# EAGLE schematic display1 (EAGLE 6.1)
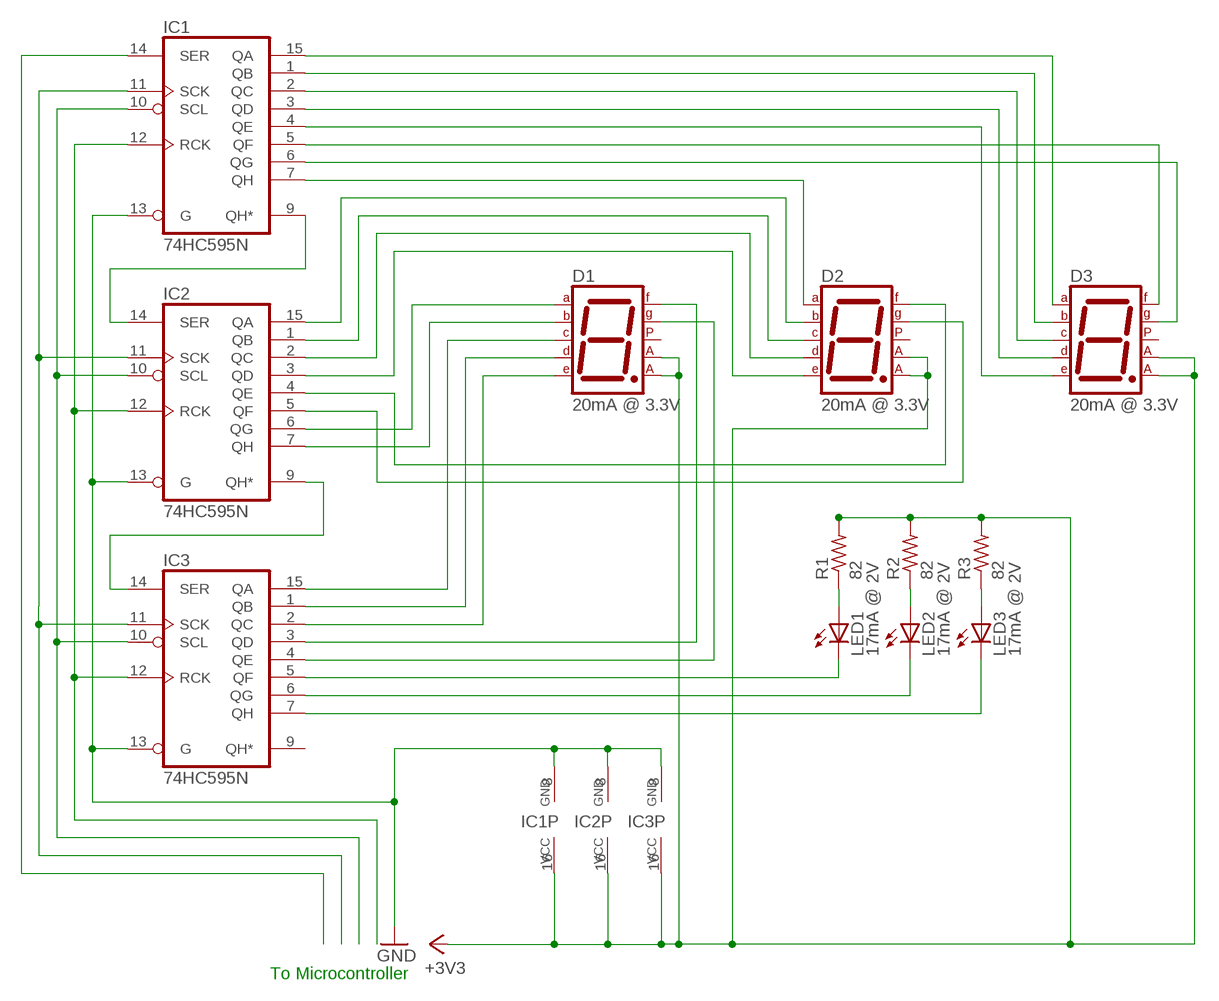
[diagram p0: schematic, sheet 1]

## Parts
D1  20mA @ 3.3V  7SEG-CA  [7SEG-13]
D2  20mA @ 3.3V  7SEG-CA  [7SEG-13]
D3  20mA @ 3.3V  7SEG-CA  [7SEG-13]
IC1  74HC595N  [DIL16]
IC2  74HC595N  [DIL16]
IC3  74HC595N  [DIL16]
LED1  17mA @ 2V  LED3MM  [LED3MM]
LED2  17mA @ 2V  LED3MM  [LED3MM]
LED3  17mA @ 2V  LED3MM  [LED3MM]
R1  82  R-US_0207/10  [0207/10]
R2  82  R-US_0207/10  [0207/10]
R3  82  R-US_0207/10  [0207/10]

## Nets
+3V3: D1.3(CA1) D1.8(CA2) D2.3(CA1) D2.8(CA2) D3.3(CA1) D3.8(CA2) IC1.16(VCC) IC2.16(VCC) IC3.16(VCC) R1.2 R2.2 R3.2
GND: IC1.8(GND) IC1.13(G) IC2.8(GND) IC2.13(G) IC3.8(GND) IC3.13(G)
N$2: IC1.9(QH*) IC2.14(SER)
N$3: IC2.9(QH*) IC3.14(SER)
N$4: IC1.12(RCK) IC2.12(RCK) IC3.12(RCK)
N$6: IC1.10(SCL) IC2.10(SCL) IC3.10(SCL)
N$7: IC1.11(SCK) IC2.11(SCK) IC3.11(SCK)
N$8: IC1.14(SER)
N$11: D3.7(A) IC1.15(QA)
N$12: D3.6(B) IC1.1(QB)
N$13: D3.4(C) IC1.2(QC)
N$14: D3.2(D) IC1.3(QD)
N$15: D3.1(E) IC1.4(QE)
N$16: D3.9(F) IC1.5(QF)
N$17: D3.10(G) IC1.6(QG)
N$18: D2.7(A) IC1.7(QH)
N$19: D2.6(B) IC2.15(QA)
N$20: D2.4(C) IC2.1(QB)
N$21: D2.2(D) IC2.2(QC)
N$22: D2.1(E) IC2.3(QD)
N$23: D2.9(F) IC2.4(QE)
N$24: D2.10(G) IC2.5(QF)
N$25: D1.7(A) IC2.6(QG)
N$26: D1.6(B) IC2.7(QH)
N$27: D1.4(C) IC3.15(QA)
N$28: D1.2(D) IC3.1(QB)
N$29: D1.1(E) IC3.2(QC)
N$30: D1.9(F) IC3.3(QD)
N$31: D1.10(G) IC3.4(QE)
N$32: IC3.5(QF) LED1.K(C)
N$33: IC3.6(QG) LED2.K(C)
N$34: IC3.7(QH) LED3.K(C)
N$35: LED1.A R1.1
N$36: LED2.A R2.1
N$37: LED3.A R3.1
Unconnected: D1.5(DP) D2.5(DP) D3.5(DP) IC3.9(QH*)

## Notes on the sheet
- To Microcontroller

## Library data of the parts
D1-D3 = special:7SEG-CA: 7-segment DISPLAY single anode, 13 mm
IC1-IC3 = 74xx-eu:74*595: 8-bit SHIFT REGISTER, output latch
LED1-LED3 = led:LED: LED OSRAM: - CHIPLED LG R971, LG N971, LY N971, LG Q971, LY Q971, LO R971, LY R971 LH N974, LH R974 LS Q976, LO Q976, LY Q976 LO Q996 - Hyper CHIPLED LW Q18S LB Q993, LB Q99A, LB R99A - SideLED LS A670, LO A670, LY A670, LG A670, LP A670 LB A673, LV A673, LT A673, LW A673 LH A674 LY A675 LS A676, LA A676, LO A676, LY A676, LW A676 LS A679, LY A679, LG A679 - Hyper Micro SIDELED® LS Y876, LA Y876, LO Y876, LY Y876 LT Y87S - SmartLED LW L88C, LW L88S LB L89C, LB L89S, LG L890 LS L89K, LO L89K, LY L89K LS L896, LA L896, LO L896, LY L896 - TOPLED LS T670, LO T670, LY T670, LG T670, LP T670 LSG T670, LSP T670, LSY T670, LOP T670, LYG T670 LG T671, LOG T671, LSG T671 LB T673, LV T673, LT T673, LW T673 LH T674 LS T676, LA T676, LO T676, LY T676, LB T676, LH T676, LSB T676, LW T676 LB T67C, LV T67C, LT T67C, LS T67K, LO T67K, LY T67K, LW E67C LS E67B, LA E67B, LO E67B, LY E67B, LB E67C, LV E67C, LT E67C LW T67C LS T679, LY T679, LG T679 LS T770, LO T770, LY T770, LG T770, LP T770 LB T773, LV T773, LT T773, LW T773 LH T774 LS E675, LA E675, LY E675, LS T675 LS T776, LA T776, LO T776, LY T776, LB T776 LHGB T686 LT T68C, LB T68C - Hyper Mini TOPLED® LB M676 - Mini TOPLED Santana® LG M470 LS M47K, LO M47K, LY M47K Source: http://www.osram.convergy.de LUXEON: - LUMILED® LXK2-PW12-R00, LXK2-PW12-S00, LXK2-PW14-U00, LXK2-PW14-V00 LXK2-PM12-R00, LXK2-PM12-S00, LXK2-PM14-U00 LXK2-PE12-Q00, LXK2-PE12-R00, LXK2-PE12-S00, LXK2-PE14-T00, LXK2-PE14-U00 LXK2-PB12-K00, LXK2-PB12-L00, LXK2-PB12-M00, LXK2-PB14-N00, LXK2-PB14-P00, LXK2-PB14-Q00 LXK2-PR12-L00, LXK2-PR12-M00, LXK2-PR14-Q00, LXK2-PR14-R00 LXK2-PD12-Q00, LXK2-PD12-R00, LXK2-PD12-S00 LXK2-PH12-R00, LXK2-PH12-S00 LXK2-PL12-P00, LXK2-PL12-Q00, LXK2-PL12-R00 Source: www.luxeon.com KINGBRIGHT: KA-3528ASYC Source: www.kingbright.com
R1-R3 = resistor:R-US_: RESISTOR, American symbol